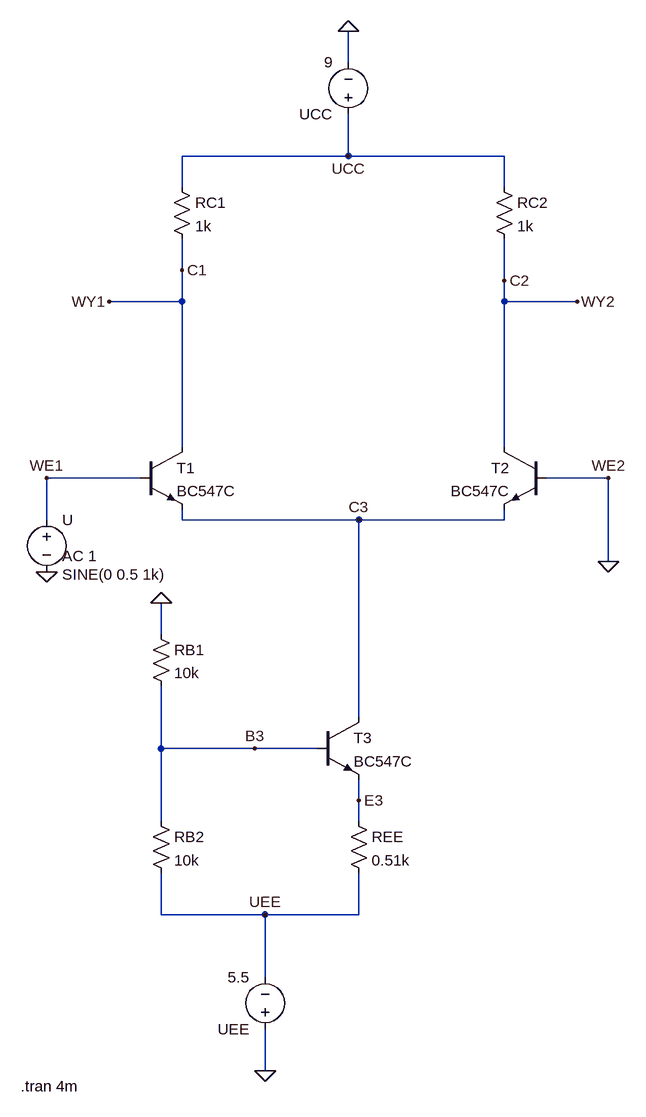
[diagram p0: schematic Lab3cz1.asc]
Lab3cz1.asc, the LTspice schematic file:
Version 4.1
SHEET 1 1348 680
WIRE 368 -960 368 -1008
WIRE 368 -816 368 -880
WIRE 368 -816 112 -816
WIRE 608 -816 368 -816
WIRE 112 -768 112 -816
WIRE 608 -768 608 -816
WIRE 112 -640 112 -688
WIRE 608 -624 608 -688
WIRE 112 -592 112 -640
WIRE 112 -592 0 -592
WIRE 608 -592 608 -624
WIRE 720 -592 608 -592
WIRE 112 -368 112 -592
WIRE 608 -368 608 -592
WIRE 48 -320 -96 -320
WIRE 768 -320 672 -320
WIRE -96 -256 -96 -320
WIRE 112 -256 112 -272
WIRE 384 -256 112 -256
WIRE 608 -256 608 -272
WIRE 608 -256 384 -256
WIRE 768 -192 768 -320
WIRE 80 -80 80 -128
WIRE 384 48 384 -256
WIRE 80 96 80 0
WIRE 224 96 80 96
WIRE 320 96 224 96
WIRE 384 176 384 144
WIRE 80 208 80 96
WIRE 384 208 384 176
WIRE 80 352 80 288
WIRE 240 352 80 352
WIRE 384 352 384 288
WIRE 384 352 240 352
WIRE 240 448 240 352
WIRE 240 592 240 528
FLAG -96 -176 0
FLAG 240 592 0
FLAG 80 -128 0
FLAG 768 -192 0
FLAG 368 -1008 0
FLAG 0 -592 WY1
FLAG 720 -592 WY2
FLAG -96 -320 WE1
FLAG 224 96 B3
FLAG 384 176 E3
FLAG 768 -320 WE2
FLAG 368 -816 UCC
FLAG 240 352 UEE
FLAG 112 -640 C1
FLAG 608 -624 C2
FLAG 384 -256 C3
SYMBOL res 64 192 R0
SYMATTR InstName RB2
SYMATTR Value 10k
SYMBOL res 368 192 R0
SYMATTR InstName REE
SYMATTR Value 0.51k
SYMBOL npn 320 48 R0
SYMATTR InstName T3
SYMATTR Value BC547C
SYMBOL res 64 -96 R0
SYMATTR InstName RB1
SYMATTR Value 10k
SYMBOL npn 48 -368 R0
SYMATTR InstName T1
SYMATTR Value BC547C
SYMBOL npn 672 -368 M0
SYMATTR InstName T2
SYMATTR Value BC547C
SYMBOL res 96 -784 R0
SYMATTR InstName RC1
SYMATTR Value 1k
SYMBOL res 592 -784 R0
SYMATTR InstName RC2
SYMATTR Value 1k
SYMBOL voltage -96 -272 R0
WINDOW 3 24 100 Left 2
WINDOW 123 24 72 Left 2
WINDOW 39 0 0 Left 0
SYMATTR Value SINE(0 0.5 1k)
SYMATTR Value2 AC 1
SYMATTR InstName U
SYMBOL voltage 368 -864 R180
WINDOW 123 0 0 Left 0
WINDOW 39 0 0 Left 0
SYMATTR InstName UCC
SYMATTR Value 9
SYMBOL voltage 240 544 R180
WINDOW 123 0 0 Left 0
WINDOW 39 0 0 Left 0
SYMATTR InstName UEE
SYMATTR Value 5.5
TEXT -136 616 Left 2 !.tran 4m

The netlist it stands for:
* Lab3cz1.asc
RB2 B3 UEE 10k
REE E3 UEE 0.51k
Q§T3 C3 B3 E3 0 BC547C
RB1 0 B3 10k
Q§T1 C1 WE1 C3 0 BC547C
Q§T2 C2 0 C3 0 BC547C
RC1 UCC C1 1k
RC2 UCC C2 1k
V§U WE1 0 SINE(0 0.5 1k) AC 1
V§UCC UCC 0 9
V§UEE 0 UEE 5.5
.model NPN NPN
.model PNP PNP
.lib standard.bjt
.tran 4m
.backanno
.end